# EAGLE schematic main (EAGLE 9.6.2)
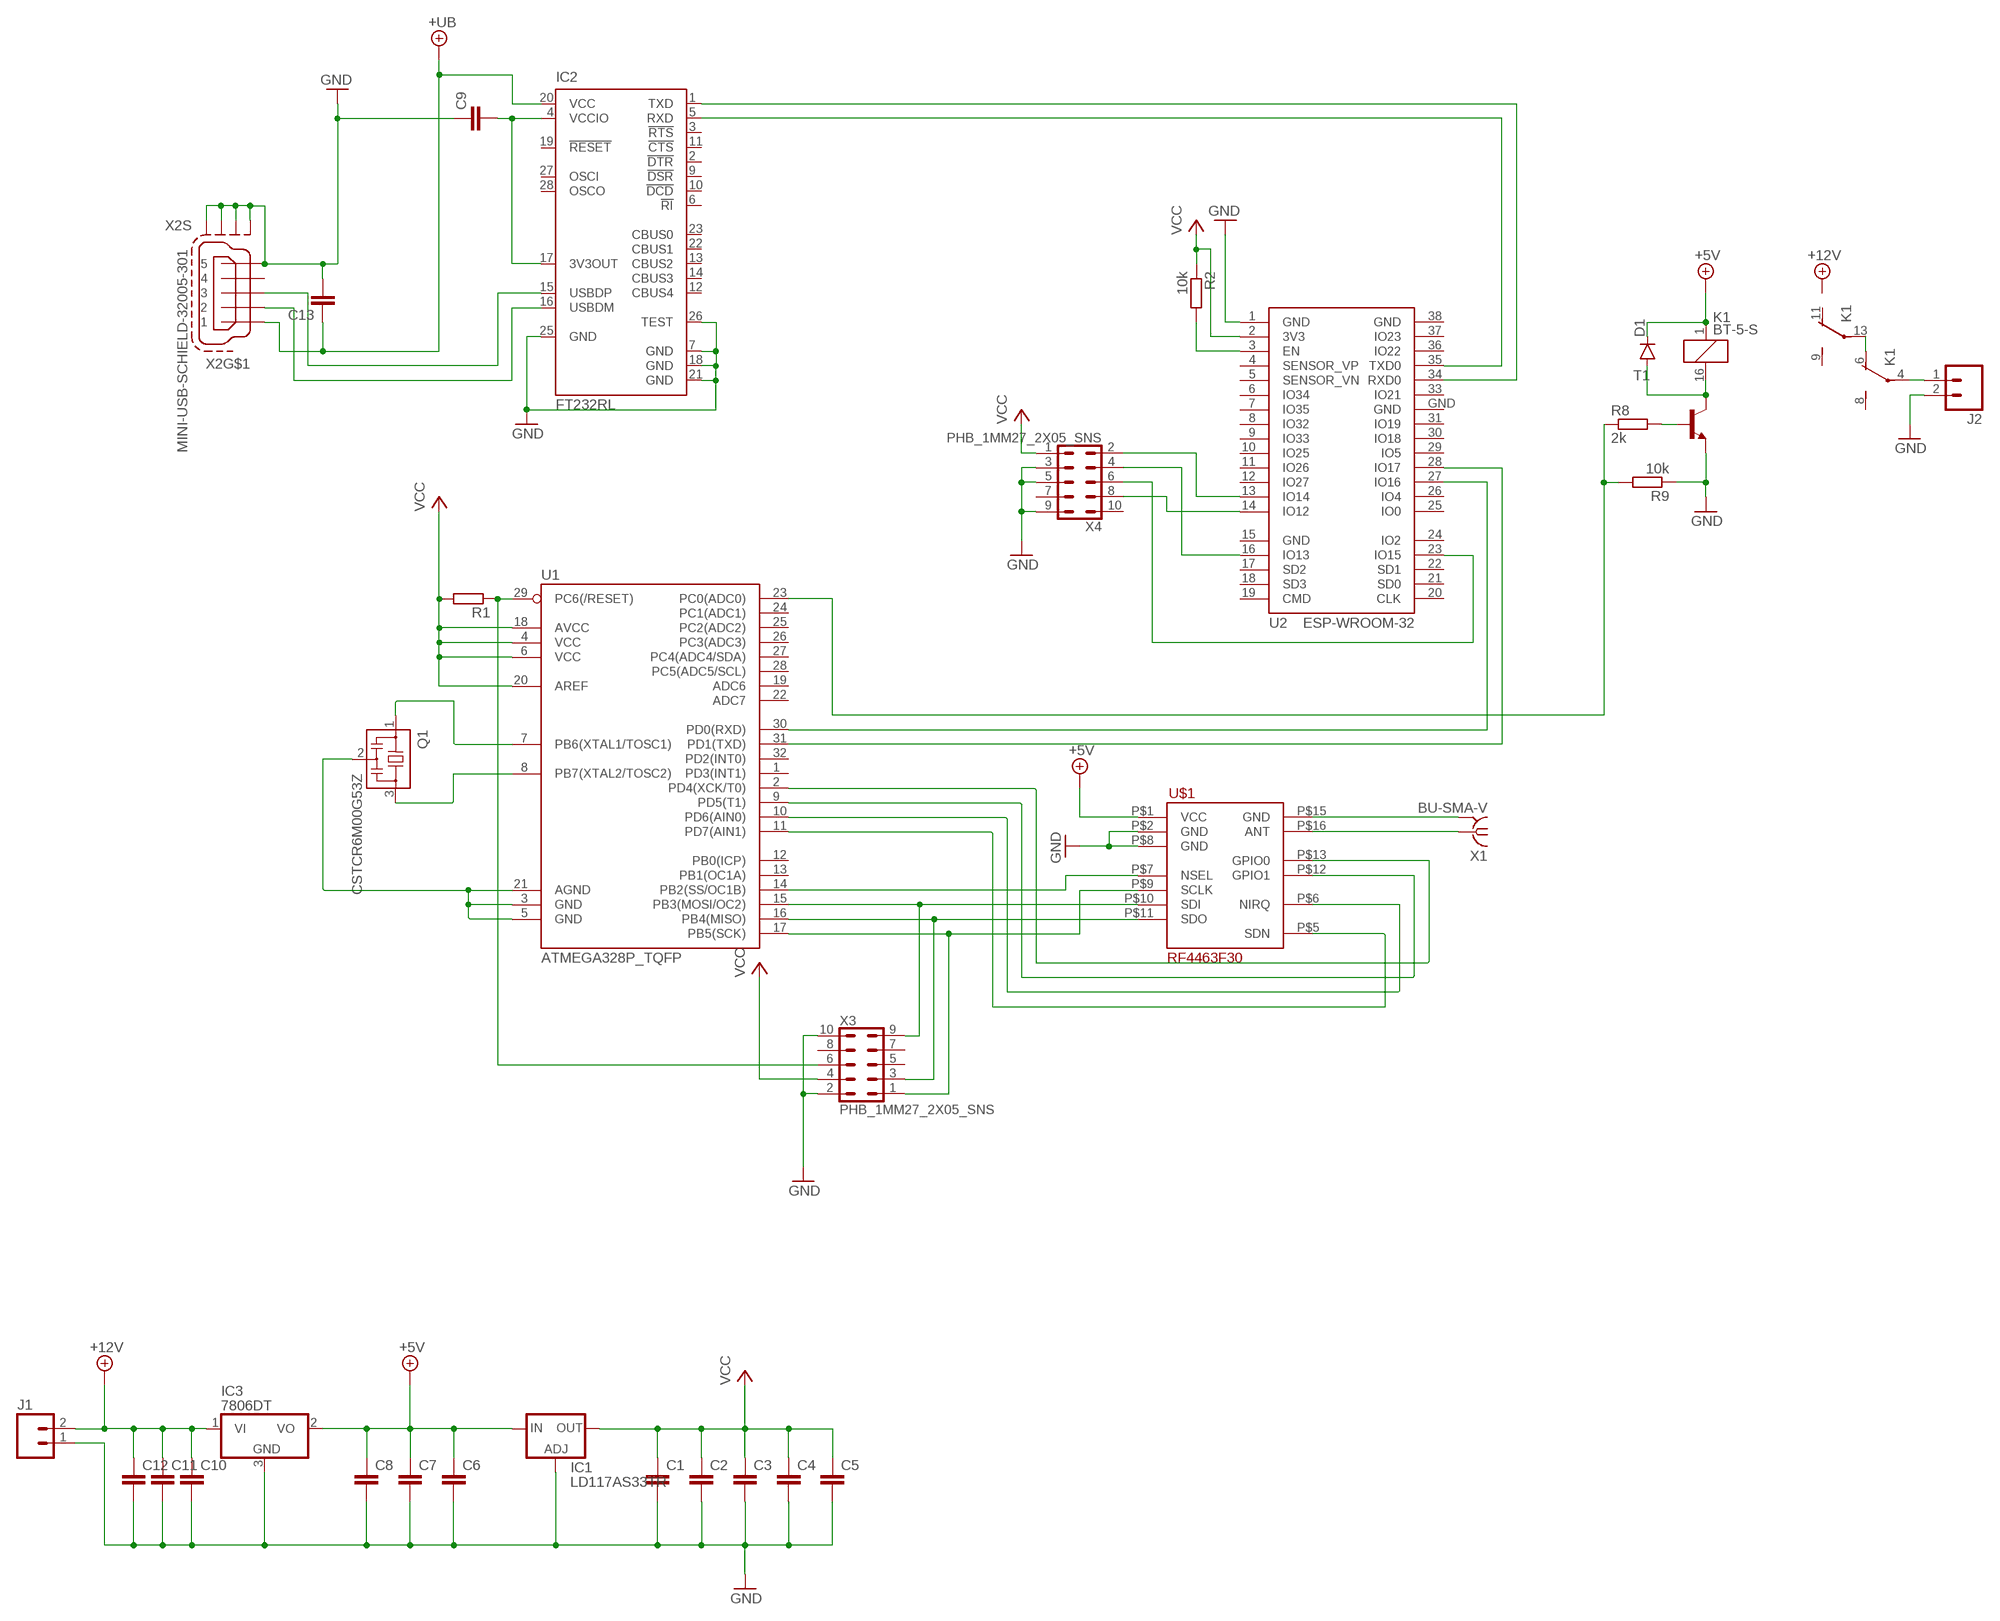
[diagram p0: schematic, sheet 1]

## Parts
C1  C-EUC1206K  [C1206K]
C2  C-EUC1206K  [C1206K]
C3  C-EUC1206K  [C1206K]
C4  C-EUC1206K  [C1206K]
C5  C-EUC1206K  [C1206K]
C6  C-EUC1206K  [C1206K]
C7  C-EUC1206K  [C1206K]
C8  C-EUC1206K  [C1206K]
C9  C-EUC1206K  [C1206K]
C10  C-EUC1206K  [C1206K]
C11  C-EUC1206K  [C1206K]
C12  C-EUC1206K  [C1206K]
C13  C-EUC1206K  [C1206K]
D1  DIODESMA  [SMA-DIODE]
IC1  LD117AS33TR  [SOT223]
IC2  FT232RL  [SSOP28]
IC3  7806DT  [TO252]
J1  M023.5MM-NO_SILK  [SCREWTERMINAL-3.5MM-2-NS]
J2  M023.5MM-NO_SILK  [SCREWTERMINAL-3.5MM-2-NS]
K1  BT-5-S  [BT-XX-S]
Q1  CSTCR6M00G53Z  [CSTCR6M]
R1  R-EU_R1206  [R1206]
R2  10k  R-EU_R1206  [R1206]
R8  2k  R-EU_R1206  [R1206]
R9  10k  R-EU_R1206  [R1206]
T1  MMBT2222ALT1-NPN-SOT23-BEC  [SOT23-BEC]
U1  ATMEGA328P_TQFP  [TQFP32-08]
U2  ESP-WROOM-32  [ESP-WROOM-32]
U$1  RF4463F30  [NICERF_16PIN_SPI_TRANSCEIVER]
X1  BU-SMA-V  [BU-SMA-V]
X2  MINI-USB-SCHIELD-32005-301  [32005-301]
X3  PHB_1MM27_2X05_SNS  [PHB_1MM27_2X05_SNS]
X4  PHB_1MM27_2X05_SNS  [PHB_1MM27_2X05_SNS]

## Nets
+5V: C6.1 C7.1 C8.1 D1.C IC1.3(IN) IC3.2(VO) K1.1 U$1.P$1(VCC)
+12V: C10.1 C11.1 C12.1 IC3.1(VI) J1.2
+UB: C13.1 IC2.20(VCC) X2.1
GND: C1.2 C2.2 C3.2 C4.2 C5.2 C6.2 C7.2 C8.2 C9.1 C10.2 C11.2 C12.2 C13.2 IC1.1(ADJ) IC2.7(GND) IC2.18(GND) IC2.21(GND) IC2.25(GND) IC2.26(TEST) IC3.3(GND) J1.1 J2.2 R9.1 T1.E U2.1(GND) U$1.P$2(GND) U$1.P$8(GND) X2.5 X2.M1(S:S1) X2.M2(S:S2) X2.M3(S:S3) X2.M4(S:S4) X3.2 X3.10 X4.3 X4.5 X4.9
N$1: U1.15(PB3(MOSI/OC2)) U$1.P$10(SDI) X3.9
N$2: U1.16(PB4(MISO)) U$1.P$11(SDO) X3.3
N$3: U1.17(PB5(SCK)) U$1.P$9(SCLK) X3.1
N$4: U1.14(PB2(SS/OC1B)) U$1.P$7(NSEL)
N$5: U1.11(PD7(AIN1)) U$1.P$5(SDN)
N$6: U1.10(PD6(AIN0)) U$1.P$6(NIRQ)
N$7: U1.9(PD5(T1)) U$1.P$12(GPIO1)
N$8: U1.2(PD4(XCK/T0)) U$1.P$13(GPIO0)
N$9: U$1.P$16(ANT) X1.1
N$10: U$1.P$15(GND) X1.2 X1.3 X1.4 X1.5
N$11: Q1.3 U1.8(PB7(XTAL2/TOSC2))
N$12: Q1.1 U1.7(PB6(XTAL1/TOSC1))
N$13: Q1.2 U1.3(GND) U1.5(GND) U1.21(AGND)
N$14: R1.1 U1.29(PC6(/RESET)) X3.6
N$15: R8.2 T1.B
N$16: R8.1 R9.2 U1.23(PC0(ADC0))
N$17: D1.A K1.16 T1.C
N$18: U2.14(IO12) X4.8
N$19: U2.13(IO14) X4.2
N$20: U2.16(IO13) X4.4
N$21: U2.23(IO15) X4.6
N$22: R2.2 U2.3(EN)
N$23: U1.30(PD0(RXD)) U2.27(IO16)
N$24: U1.31(PD1(TXD)) U2.28(IO17)
N$25: K1.6(-1:O) K1.13(-2:P)
N$26: J2.1 K1.4(-1:P)
N$27: IC2.16(USBDM) X2.2
N$28: IC2.5(RXD) U2.35(TXD0)
N$29: IC2.15(USBDP) X2.3
N$30: C9.2 IC2.4(VCCIO) IC2.17(3V3OUT)
N$31: IC2.1(TXD) U2.34(RXD0)
VCC: C1.1 C2.1 C3.1 C4.1 C5.1 IC1.4(OUT) R1.2 R2.1 U1.4(VCC) U1.6(VCC) U1.18(AVCC) U1.20(AREF) U2.2(3V3) X3.4 X4.1
Unconnected: IC2.2(!DTR) IC2.3(!RTS) IC2.6(!RI) IC2.9(!DSR) IC2.10(!DCD) IC2.11(!CTS) IC2.12(CBUS4) IC2.13(CBUS2) IC2.14(CBUS3) IC2.19(!RESET) IC2.22(CBUS1) IC2.23(CBUS0) IC2.27(OSCI) IC2.28(OSCO) K1.8(-1:S) K1.9(-2:S) K1.11(-2:O) U1.1(PD3(INT1)) U1.12(PB0(ICP)) U1.13(PB1(OC1A)) U1.19(ADC6) U1.22(ADC7) U1.24(PC1(ADC1)) U1.25(PC2(ADC2)) U1.26(PC3(ADC3)) U1.27(PC4(ADC4/SDA)) U1.28(PC5(ADC5/SCL)) U1.32(PD2(INT0)) U2.4(SENSOR_VP) U2.5(SENSOR_VN) U2.6(IO34) U2.7(IO35) U2.8(IO32) U2.9(IO33) U2.10(IO25) U2.11(IO26) U2.12(IO27) U2.17(SD2) U2.18(SD3) U2.19(CMD) U2.20(CLK) U2.21(SD0) U2.22(SD1) U2.24(IO2) U2.25(IO0) U2.26(IO4) U2.29(IO5) U2.30(IO18) U2.31(IO19) U2.33(IO21) U2.36(IO22) U2.37(IO23) X2.4 X3.5 X3.7 X3.8 X4.7 X4.10

## Power pins joined to a net without a drawn wire
GND: U2.15(GND) U2.38(GND) U2.GND

## Library data of the parts
C1-C8 C10-C12 = rcl:C-EU: CAPACITOR, European symbol; SPICEPREFIX: C
C9 C13 = rcl:C-EU: CAPACITOR, European symbol
D1 = SparkFun-DiscreteSemi:DIODE: Diode These are standard reverse protection diodes and small signal diodes. SMA package can handle up to about 1A. SOD-323 can handle about 200mA. What the SOD-323 package when ordering, there are some mfgs out there that are 5-pin packages.
IC1 = v-reg:LD117A?*: Low drop fixed and adjustable positive voltage regulators 1 A Source: http://www.st.com/stonline/products/literature/ds/7194/ld1117axx.pdf
IC2 = ftdichip:FT232R: Source: http://www.ftdichip.com/Documents/DataSheets/DS_FT232R_v104.pdf; MPN: FT232RL; OC_FARNELL: 1146032; OC_NEWARK: 91K9918
IC3 = linear:78*: Positive VOLTAGE REGULATOR Source: http://cache.national.com/ds/LM/LM78L05.pdf http://www.fairchildsemi.com/ds/LM/LM7805.pdf
J1 J2 = SparkFun-Connectors:M02: Standard 2-pin 0.1" header. Use with - straight break away headers ( PRT-00116) - right angle break away headers (PRT-00553) - swiss pins (PRT-00743) - machine pins (PRT-00117) - female headers (PRT-00115) Molex polarized connector foot print use with: PRT-08233 with associated crimp pins and housings. 2.54_SCREWTERM for use with PRT-10571. 3.5mm Screw Terminal footprints for PRT-08084 5mm Screw Terminal footprints for use with PRT-08432; PROD_ID: CONN-08399
K1 = relay:BT-*-S: KLEIN RELAIS WASCHDICHT 2 Wechsler Distriibutor: Conrad Electronic, Bestell Nr.: 505226-13 - 24V 505226-13 - 5V 505170-13 - 12V 505170-13 - 48V Bestar Electric Ltd. Source: http://www2.produktinfo.conrad.com/datenblaetter/500000-524999/505226-da-01-en-Kleinrelais_waschdicht_24V.pdf; OC_FARNELL: unknown; OC_NEWARK: unknown
Q1 = murata-filter:CSTCR: Resonator Source: murata.co.jp; MPN: CSTCR6M00G53-R0; OC_FARNELL: 1170434; OC_NEWARK: 25M8759
R1 = rcl:R-EU_: RESISTOR, European symbol; SPICEPREFIX: R
R2 R8 R9 = resistor:R-EU_: RESISTOR, European symbol
T1 = transistor-neu-to92:*-NPN-: NPN Transistror
U1 = SparkFun-DigitalIC:ATMEGA328P_TQFP; PROD_ID: IC-09069
U2 = esp32:ESP-WROOM-32: Espressif Systems ESP-WROOM-32
U$1 = Nomeo-Transceivers:RF4463F30
X1 = con-coax:BU-SMA-V: FEMALE SMA CONNECTOR Radiall distributor RS 112-3794; OC_FARNELL: unknown; OC_NEWARK: unknown
X2 = con-cypressindustries:MINI-USB-SCHIELD-: MINI USB-B Conector Source: www.cypressindustries.com; OC_FARNELL: unknown; OC_NEWARK: unknown
X3 X4 = _hhn_con_pinhead_box_1mm27:PHB_1MM27_2X05_*: Pin Header Box-Type, 1.27mm/0.5"/50mil Pitch, 2x05 Circuits Note: see library description for an important note about THT-version